# EAGLE design FioSaber (EAGLE 6.5.0)
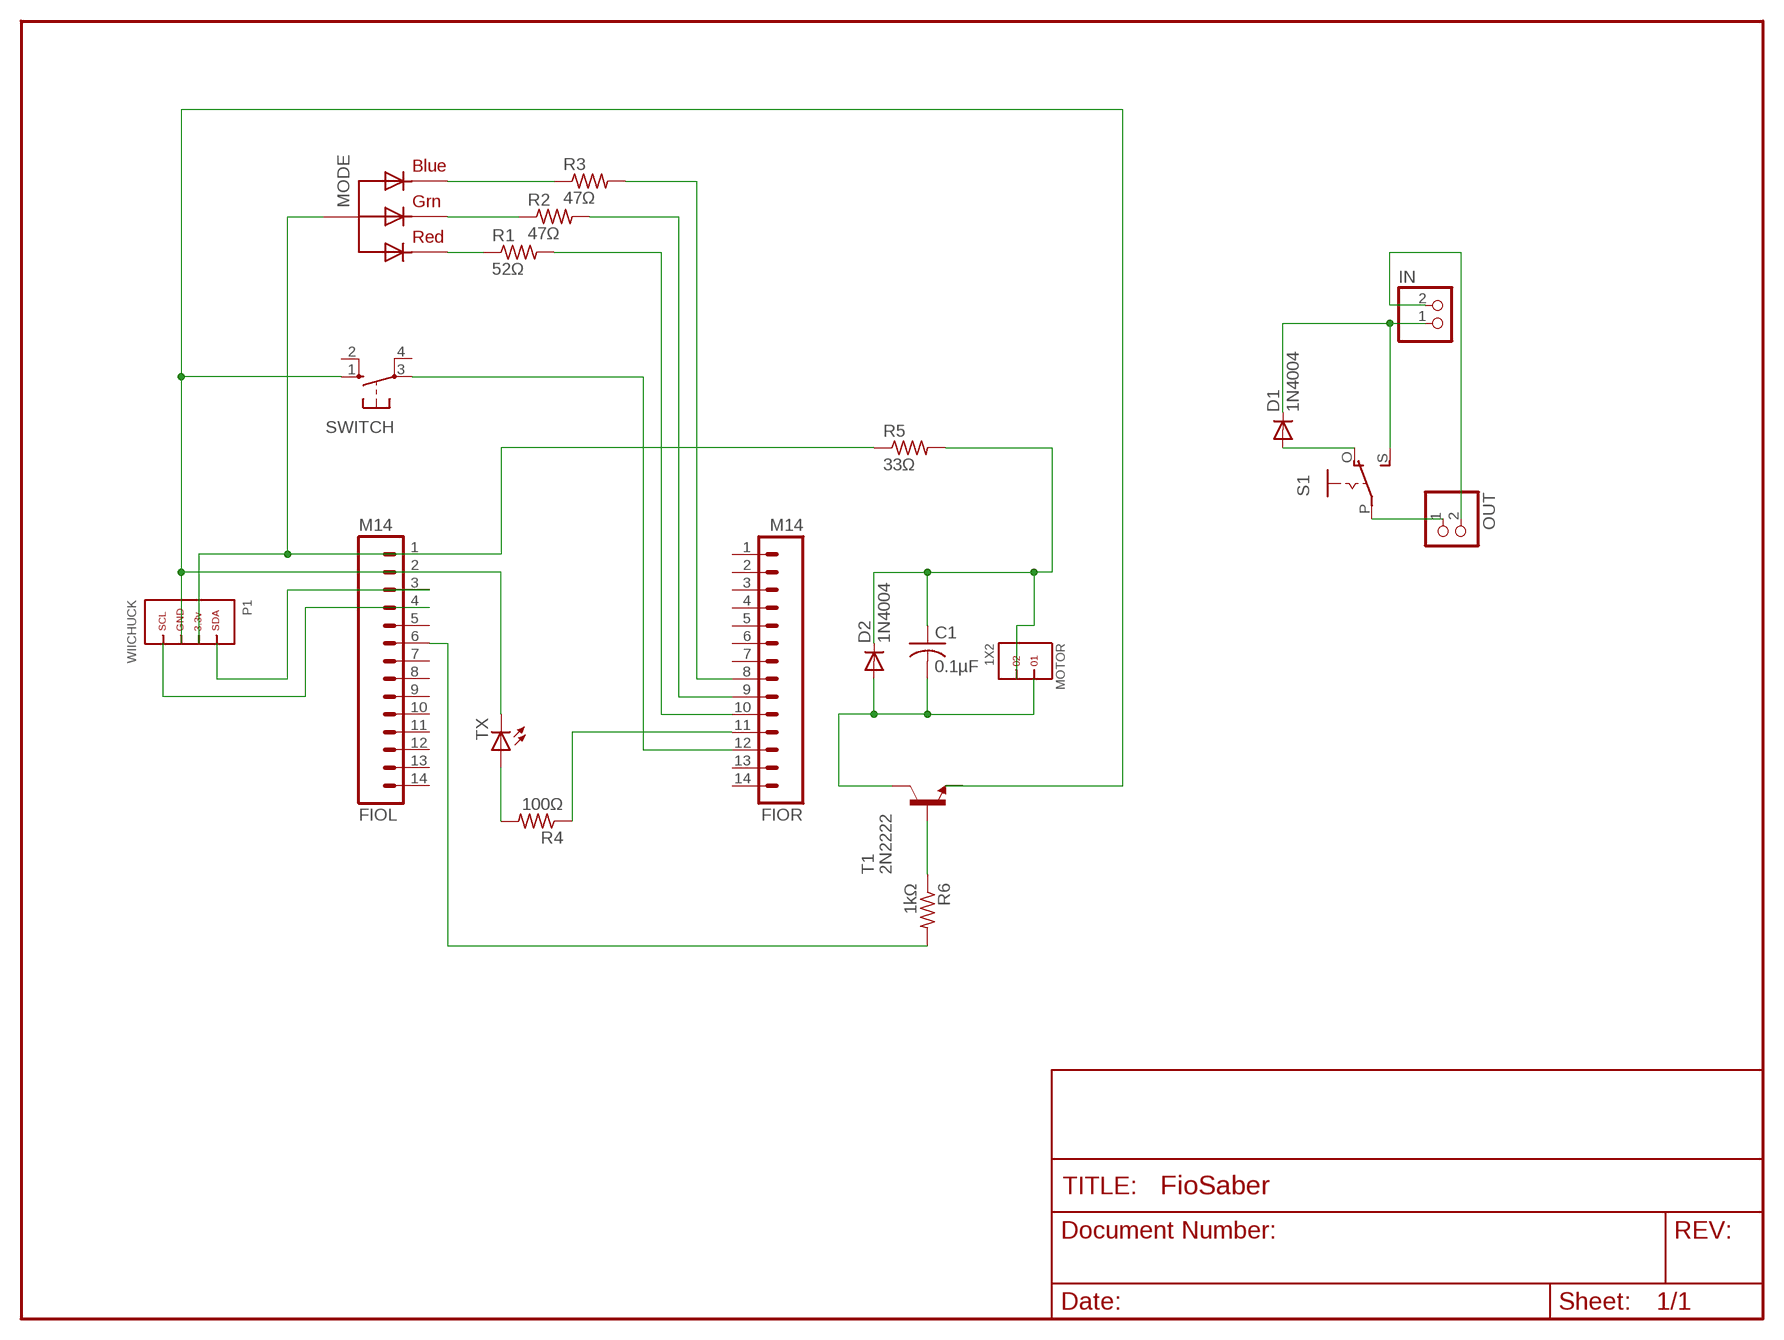
[diagram p0: schematic, sheet 1]

## Parts
C1  0.1µF  C-US025-025X050  [C025-025X050]
D1  1N4004  [DO41-10]
D2  1N4004  [DO41-10]
FIOL  M14  [1X14]
FIOR  M14  [1X14]
IN  JST_2PIN-THM-RA  [JST-PH-2-THM-RA]
MODE  RGBLED_CA-PIRANHA  [PIRANHA5MM]
MOTOR  1X2  [1X2]
OUT  JST_2PIN-THM-RA  [JST-PH-2-THM-RA]
P1  WIICHUCK  [MEMOREX_RECEIVER]
R1  52Ω  R-US_0207/7  [0207/7]
R2  47Ω  R-US_0207/7  [0207/7]
R3  47Ω  R-US_0207/7  [0207/7]
R4  100Ω  R-US_0207/7  [0207/7]
R5  33Ω  R-US_0207/7  [0207/7]
R6  1kΩ  R-US_0207/7  [0207/7]
S1  EG1218S  [EG1218]
SWITCH  10-XX  [B3F-10XX]
T1  2N2222  [TO92-EBC-OVAL]
TX  LED3MM  [LED3MM]

## Nets
N$1: FIOL.1 MODE.4(VCC) P1.SDA R5.1
N$2: D1.C IN.1 S1.S
N$3: FIOL.4 P1.GND
N$4: FIOL.3 P1.PWR
N$5: D1.A S1.O
N$6: MODE.2(RED) R1.1
N$8: MODE.3(GREEN) R2.1
N$9: MODE.1(BLUE) R3.1
N$10: OUT.1 S1.P
N$11: IN.2 OUT.2
N$12: FIOR.12 SWITCH.3(P)
N$13: FIOR.10 R1.2
N$14: FIOR.9 R2.2
N$15: FIOR.8 R3.2
N$16: FIOL.6 R6.2
N$17: FIOR.11 R4.1
N$18: R6.1 T1.B
N$19: C1.2 D2.A MOTOR.1 T1.C
N$20: C1.1 D2.C MOTOR.2 R5.2
N$24: FIOL.2 P1.SCL SWITCH.1(S) TX.K(C)
N$25: R4.2 TX.A
Unconnected: FIOL.5 FIOL.7 FIOL.8 FIOL.9 FIOL.10 FIOL.11 FIOL.12 FIOL.13 FIOL.14 FIOR.1 FIOR.2 FIOR.3 FIOR.4 FIOR.5 FIOR.6 FIOR.7 FIOR.13 FIOR.14 SWITCH.2(S1) SWITCH.4(P1) T1.E

## Library data of the parts
C1 = rcl:C-US: CAPACITOR, American symbol
D1 D2 = adafruit:1N4004: DIODE General purpose 1N400x type rectifier (With bigger pads) http://www.ladyada.net/library/pcb/eaglelibrary.html
FIOL FIOR = SparkFun:M14: Header 14 Standard 14-pin 0.1" header. Use with straight break away headers (SKU : PRT-00116), right angle break away headers (PRT-00553), swiss pins (PRT-00743), machine pins (PRT-00117), and female headers (PRT-00115).
IN OUT = adafruit:JST_2PIN: JST 2-Pin Connectors of various flavors SMT-RA (S2B-PH-SM4) 4UConnector #17311 SMT (B2B-PH-SM4) THM-RA (S2B-PH) THM (B2B-PH)
MODE = adafruit:RGBLED_CA: RGB LED, common-anode 5MM Staggered pins 5mm Piranha package http://www.ladyada.net/library/pcb/eaglelibrary.html
MOTOR = headers(.1in):1X2
P1 = nintendo:WIICHUCK
R1-R6 = adafruit:R-US_: RESISTOR, American symbol
S1 = adafruit:EG1218: SLIDING SWITCH 0.1" spacing through hole, vertical SPDT slide switch http://www.ladyada.net/library/pcb/eaglelibrary.html
SWITCH = switch-omron:10-XX: OMRON SWITCH; MPN: B3F-1000; OC_FARNELL: 176432; OC_NEWARK: 36M3542
T1 = adafruit:2N2222: NPN TRANSISTOR Big oval pads
TX = adafruit:LED: LED OSRAM: - CHIPLED LG R971, LG N971, LY N971, LG Q971, LY Q971, LO R971, LY R971 LH N974, LH R974 LS Q976, LO Q976, LY Q976 LO Q996 - Hyper CHIPLED LW Q18S LB Q993, LB Q99A, LB R99A - SideLED LS A670, LO A670, LY A670, LG A670, LP A670 LB A673, LV A673, LT A673, LW A673 LH A674 LY A675 LS A676, LA A676, LO A676, LY A676, LW A676 LS A679, LY A679, LG A679 - Hyper Micro SIDELED® LS Y876, LA Y876, LO Y876, LY Y876 LT Y87S - SmartLED LW L88C, LW L88S LB L89C, LB L89S, LG L890 LS L89K, LO L89K, LY L89K LS L896, LA L896, LO L896, LY L896 - TOPLED LS T670, LO T670, LY T670, LG T670, LP T670 LSG T670, LSP T670, LSY T670, LOP T670, LYG T670 LG T671, LOG T671, LSG T671 LB T673, LV T673, LT T673, LW T673 LH T674 LS T676, LA T676, LO T676, LY T676, LB T676, LH T676, LSB T676, LW T676 LB T67C, LV T67C, LT T67C, LS T67K, LO T67K, LY T67K, LW E67C LS E67B, LA E67B, LO E67B, LY E67B, LB E67C, LV E67C, LT E67C LW T67C LS T679, LY T679, LG T679 LS T770, LO T770, LY T770, LG T770, LP T770 LB T773, LV T773, LT T773, LW T773 LH T774 LS E675, LA E675, LY E675, LS T675 LS T776, LA T776, LO T776, LY T776, LB T776 LHGB T686 LT T68C, LB T68C - Hyper Mini TOPLED® LB M676 - Mini TOPLED Santana® LG M470 LS M47K, LO M47K, LY M47K Source: http://www.osram.convergy.de/

## Net classes
0 Default: width 0.203 mm, clearance 0.205 mm
2 LEDPower: width 0.203 mm
3 ButtonSignal: width 0.203 mm

## Board
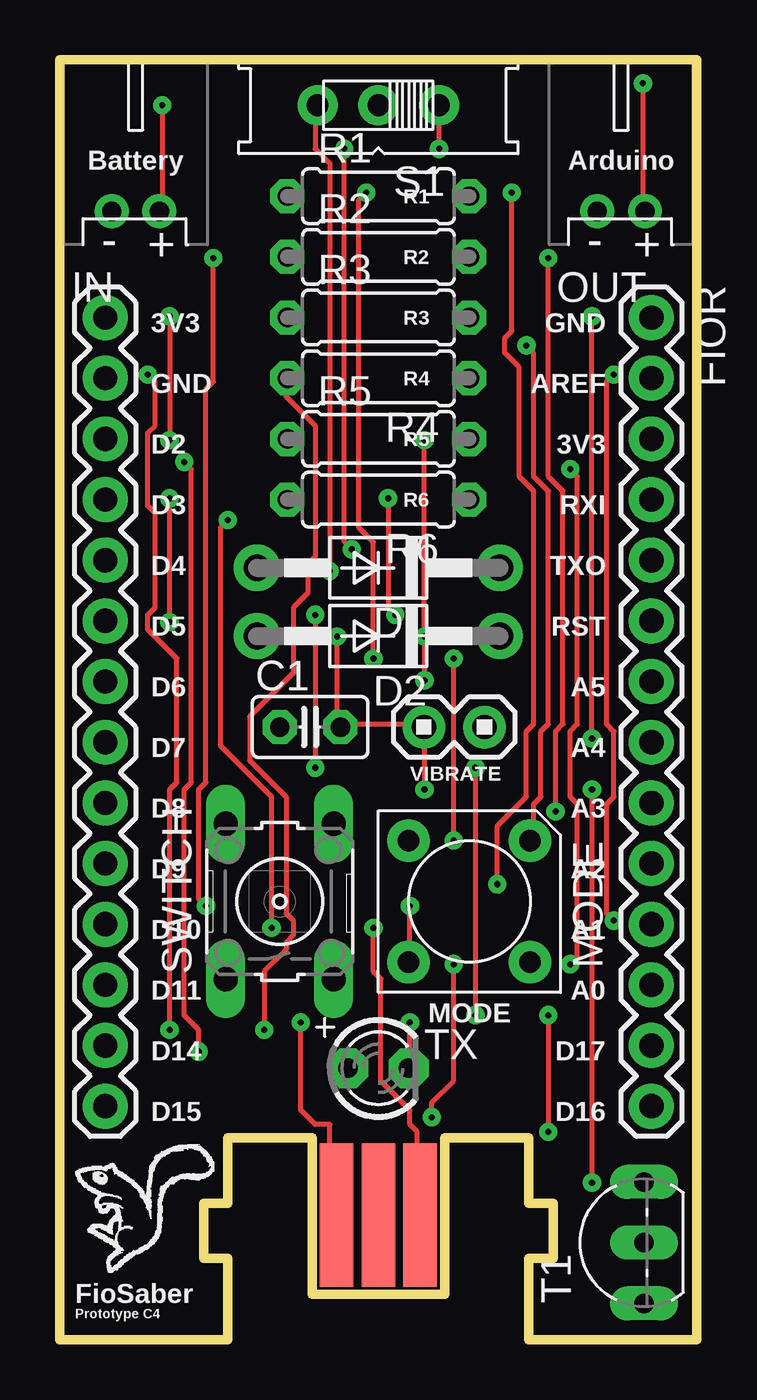
[diagram p1: board, top side]
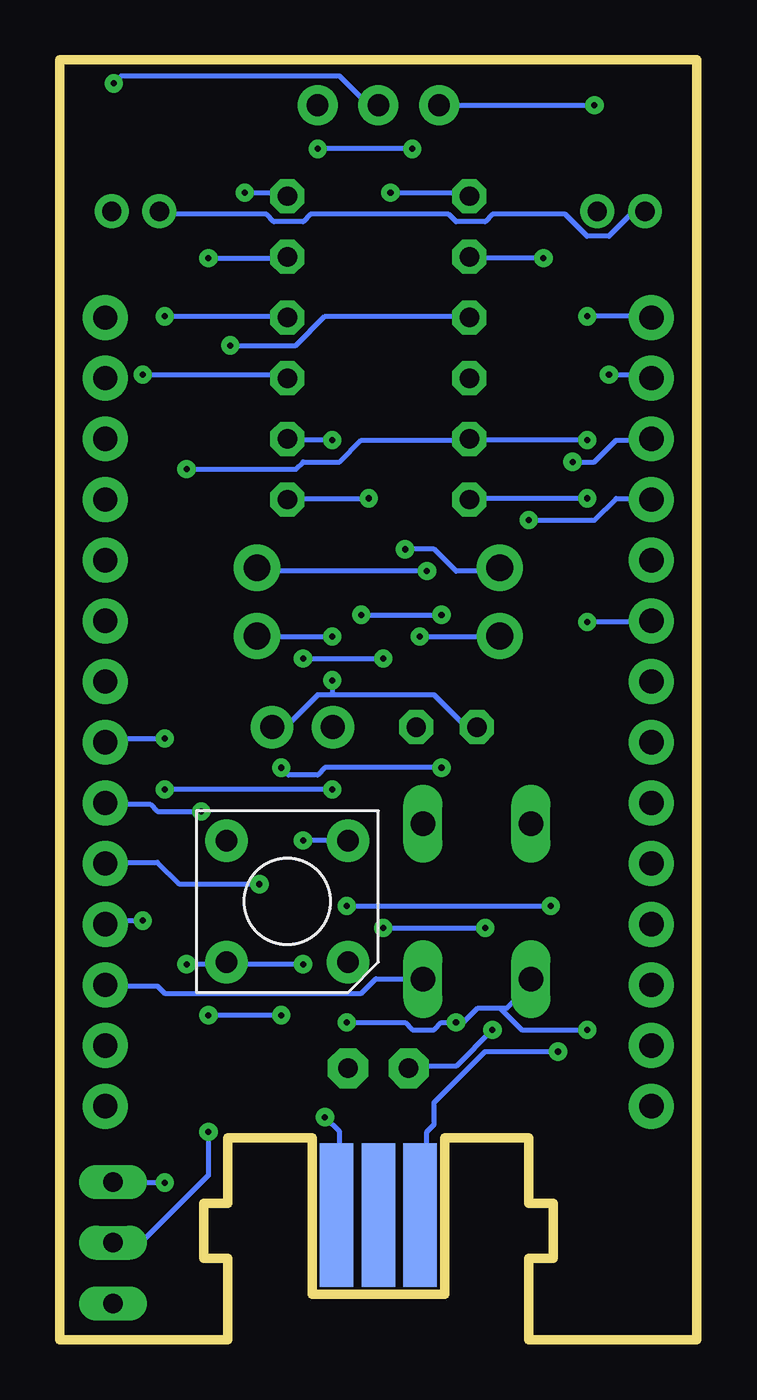
[diagram p2: board, bottom side, seen from below]

Size 26.67 x 53.59 mm. Coordinates in mm from the lower left corner, seen from the top.
Outline: 0,0 7.04,0 7.04,3.4 6.02,3.4 6.02,5.71 7.04,5.71 7.04,8.46 10.57,8.46 10.57,1.91 16.1,1.91 16.1,8.46 19.63,8.46 19.63,5.71 20.65,5.71 20.65,3.4 19.63,3.4 19.63,0 26.67,0 26.67,53.59 0,53.59 0,0
Copper layers (1*16): Top 0.035mm / dielectric 1.5mm / Bottom 0.035mm
Design rules "SparkFun *": minimum track width 8mil, minimum drill 10mil, track to track 7mil, track to pad 7mil, pad to pad 7mil, via to via 7mil, smd to smd 7mil, copper to edge 10mil, drill to drill 8mil, minimum pad ring 12mil, minimum via ring 10mil, stop-mask expansion 4mil, vias tented up to drill 20mil, thermal gap 10mil

### Footprints (pad centres in the part's own frame; a part is rotated, then mirrored left to right if it is on the bottom)
C025-025X050 = drill 0.813 octagon: 1 -1.27,0; 2 1.27,0
DO41-10 = drill 1.118 pad 1.93: A 5.08,0; C -5.08,0
1X14 = drill 1.016 pad 1.88: 1 0,0; 2 2.54,0; 3 5.08,0; 4 7.62,0; 5 10.16,0; 6 12.7,0; 7 15.24,0; 8 17.78,0; 9 20.32,0; 10 22.86,0; 11 25.4,0; 12 27.94,0; 13 30.48,0; 14 33.02,0
JST-PH-2-THM-RA = drill 0.8 pad 1.422: 1 1,0; 2 -1,0
PIRANHA5MM = drill 0.9 pad 1.778: 1 -2.54,2.54; 2 -2.54,-2.54; 3 2.54,-2.54; 4 2.54,2.54
1X2 = drill 1.016 pad 1.778: 1 0,0; 2 2.54,0
MEMOREX_RECEIVER = smd 1.4 x 6 bottom: ATT 0,5.6; PWR -1.75,5.6; SDA 1.75,5.6 | smd 1.4 x 6: GND 1.75,5.6; NC 0,5.6; SCL -1.75,5.6
0207/7 = drill 0.813 octagon: 1 -3.81,0; 2 3.81,0
EG1218 = drill 0.9 pad 1.676: O -2.54,0; P 0,0; S 2.54,0
B3F-10XX = drill 1.016 long: 1 -3.251,2.261; 2 3.251,2.261; 3 -3.251,-2.261; 4 3.251,-2.261
TO92-EBC-OVAL = drill 0.813 long: B 0,-1.27; C 2.54,-1.27; E -2.54,-1.27
LED3MM = drill 0.813 pad 1.676 octagon: A -1.27,0; K 1.27,0

### Placement (x,y rotation side)
C1  10.48,25.65 0 top
D1  13.33,32.32 180 top
D2  13.33,29.46 180 top
FIOL  1.91,42.8 270 top
FIOR  24.77,42.8 270 top
IN  3.17,47.24 0 top
MODE  17.15,18.35 270 top
MOTOR  15.24,25.65 0 top
OUT  23.5,47.24 0 top
P1  13.33,-0.38 0 top
R1  13.33,47.88 0 top
R2  13.33,45.34 0 top
R3  13.33,42.8 0 top
R4  13.33,40.26 180 top
R5  13.33,37.72 0 top
R6  13.33,35.18 180 top
S1  13.33,51.69 180 top
SWITCH  9.21,18.35 90 top
T1  23.18,4.06 90 top
TX  13.33,11.37 0 top

### Tracks (layer width: path | path; a pad name or v marks a point on that pad's centre or on a via)
N$1  (via drill 0.25)
  Top 0.203: v4.6,42.85 v4.6,37.67 | v16.48,15.72 16.48,10.85 15.57,9.93 v15.57,9.32 | v21.36,36.45 21.67,36.14 21.67,25.78 21.36,25.48 21.36,22.73 21.67,22.43 21.67,16.03 v21.36,15.72
  Bottom 0.203: v4.6,37.67 9.47,37.67 R5.1 9.78,37.67 14.05,37.67 14.96,36.75 16.48,36.75 16.79,36.45 v21.36,36.45 | v4.6,42.85 2.16,42.85 FIOL.1 | v16.48,15.72 19.53,15.72 MODE.4 19.84,15.72 v21.36,15.72 | v15.57,9.32 14.96,8.71 14.96,5.36 P1.SDA
N$2  (via drill 0.25)
  Top 0.203: v4.29,51.69 4.29,47.42 IN.1 | v11.3,32.18 11.3,49.25 10.69,49.86 10.69,51.69 S1.S
  Bottom 0.203: S1.S v4.29,51.69 | v11.3,32.18 18.31,32.18 D1.C
N$3  (via drill 0.25)
  Top 0.203: v7.04,34.31 6.73,34.01 6.73,24.87 8.87,22.73 v8.87,17.25 | v13.13,17.25 13.13,15.42 13.44,15.11 13.44,10.85 14.66,9.63 14.66,9.02 14.96,8.71 14.96,5.36 P1.GND
  Bottom 0.203: v7.04,34.31 4.29,34.31 3.38,35.23 2.16,35.23 FIOL.4 | v13.13,17.25 v8.87,17.25
N$4  (via drill 0.25)
  Top 0.203: v5.21,36.75 5.51,36.45 5.51,23.34 5.21,23.04 5.21,13.59 5.82,12.98 v5.82,12.06
  Bottom 0.203: v5.21,36.75 4.29,36.75 3.38,37.67 2.16,37.67 FIOL.3 | v5.82,12.06 8.87,12.06 11,9.93 11,9.02 11.3,8.71 11.3,7.19 11.61,6.88 11.61,5.36 P1.PWR
N$5  (via drill 0.25)
  Top 0.203: v15.88,49.86 S1.O | v11.91,49.86 11.91,33.4 v12.22,33.1
  Bottom 0.203: v11.91,49.86 v15.88,49.86 | v12.22,33.1 11,33.1 10.08,32.18 8.26,32.18 D1.A
N$6  (via drill 0.25)
  Top 0.203: v12.83,48.03 12.52,47.73 12.52,34.01 13.13,33.4 v13.13,28.52 | v16.48,20.9 v16.48,28.52
  Bottom 0.203: v12.83,48.03 9.78,48.03 R1.1 | v16.48,28.52 v13.13,28.52 | v16.48,20.9 14.66,20.9 MODE.2
N$8  (via drill 0.25)
  Top 0.203: v6.43,45.29 6.43,40.11 6.12,39.8 6.12,23.34 5.82,23.04 5.82,18.47 v6.12,18.16 | v14.66,18.16 14.66,16.03 MODE.3
  Bottom 0.203: v6.43,45.29 9.47,45.29 R2.1 | v14.66,18.16 v6.12,18.16
N$9  (via drill 0.25)
  Top 0.203: v19.53,41.63 19.84,41.33 19.84,36.14 20.45,35.53 20.45,25.78 20.14,25.48 20.14,22.73 19.84,22.43 19.84,20.9 MODE.1
  Bottom 0.203: v19.53,41.63 16.79,41.63 15.57,42.85 9.78,42.85 R3.1
N$10  (via drill 0.25)
  Top 0.203: v24.41,52.6 24.41,47.42 OUT.1
  Bottom 0.203: v24.41,52.6 24.11,52.91 14.96,52.91 13.74,51.69 S1.P
N$11
  Bottom 0.203: OUT.2 22.28,47.12 18.01,47.12 17.7,46.81 16.48,46.81 16.18,47.12 10.39,47.12 10.08,46.81 8.87,46.81 8.56,47.12 5.51,47.12 4.6,46.2 3.68,46.2 2.77,47.12 2.46,47.12 IN.2
N$12
  Bottom 0.203: SWITCH.3 11.61,15.11 13.44,15.11 14.05,14.5 22.28,14.5 22.58,14.81 24.71,14.81 FIOR.12
N$13  (via drill 0.25)
  Top 0.203: v18.92,48.03 18.92,42.24 18.62,41.93 18.62,41.33 19.23,40.72 19.23,36.14 19.84,35.53 19.84,25.78 19.53,25.48 19.53,22.73 18.31,21.51 v18.31,19.07
  Bottom 0.203: v18.92,48.03 17.4,48.03 R1.2 | v18.31,19.07 21.67,19.07 22.58,19.99 24.71,19.99 FIOR.10
N$14  (via drill 0.25)
  Top 0.203: v20.45,45.29 20.45,36.14 21.06,35.53 21.06,25.78 20.75,25.48 v20.75,22.12
  Bottom 0.203: v20.45,45.29 17.4,45.29 R2.2 | v20.75,22.12 22.58,22.12 22.89,22.43 24.71,22.43 FIOR.9
N$15  (via drill 0.25)
  Top 0.203: v22.28,25.17 v22.28,42.85
  Bottom 0.203: v22.28,42.85 17.4,42.85 R3.2 | v22.28,25.17 24.71,25.17 FIOR.8
N$16  (via drill 0.25)
  Top 0.203: v4.6,30.05 v4.6,35.23
  Bottom 0.203: v4.6,35.23 9.47,35.23 R6.2 | v4.6,30.05 2.16,30.05 FIOL.6
N$17  (via drill 0.25)
  Top 0.203: v23.19,40.41 22.89,40.11 22.89,25.78 23.19,25.48 23.19,22.73 22.89,22.43 22.89,17.86 v23.19,17.55
  Bottom 0.203: v23.19,40.41 17.4,40.41 R4.1 | v23.19,17.55 24.71,17.55 FIOR.11
N$18  (via drill 0.25)
  Top 0.203: v20.45,13.59 v20.45,8.71 | v17.4,23.95 v17.4,13.59 | v10.69,30.35 v10.69,23.95 | v14.05,30.35 13.74,30.66 v13.74,35.23
  Bottom 0.203: v20.45,8.71 20.45,6.88 23.19,4.14 24.41,4.14 T1.B | v17.4,13.59 v20.45,13.59 | v17.4,23.95 17.09,23.65 15.88,23.65 15.57,23.95 v10.69,23.95 | v14.05,30.35 v10.69,30.35 | v13.74,35.23 17.09,35.23 R6.1
N$19  (via drill 0.25)
  Top 0.203: v22.28,23.04 v22.28,6.58 | v15.27,23.04 15.27,25.48 MOTOR.1 14.96,25.78 11.91,25.78 C1.2 11.61,25.78 v11.61,29.44
  Bottom 0.203: v22.28,6.58 24.41,6.58 T1.C | v15.27,23.04 v22.28,23.04 | v11.61,29.44 8.26,29.44 D2.A
N$20  (via drill 0.25)
  Top 0.203: v15.27,37.67 v15.27,29.44 v15.27,27.61
  Bottom 0.203: 15.27,27 11,27 9.78,25.78 9.47,25.78 C1.1 | 15.27,27 15.88,27 17.09,25.78 17.7,25.78 MOTOR.2 | v15.27,37.67 17.09,37.67 R5.2 | v15.27,29.44 18.31,29.44 D2.C | v15.27,27.61 15.27,27
N$24  (via drill 0.25)
  Top 0.203: v3.68,40.41 3.99,40.11 3.99,38.28 3.68,37.97 3.68,34.92 3.99,34.62 3.99,30.66 3.68,30.35 3.68,29.74 4.9,28.52 4.9,23.34 4.6,23.04 v4.6,12.98 | v14.66,13.28 14.66,11.46 TX.K | v10.08,13.28 10.08,9.63 10.69,9.02 11.3,9.02 11.3,5.36 P1.SCL
  Bottom 0.203: v3.68,40.41 2.16,40.41 FIOL.2 | v4.6,12.98 7.34,12.98 8.26,13.89 | 8.26,13.89 9.17,13.89 9.78,13.28 v10.08,13.28 10.69,13.28 11,12.98 11.91,12.98 12.22,13.28 v14.66,13.28 | 8.26,13.89 7.95,13.89 7.04,14.81 SWITCH.1
N$25  (via drill 0.25)
  Top 0.203: v8.56,12.98 8.56,15.42 9.47,16.33 9.47,16.64 9.78,16.94 9.78,17.55 9.47,17.86 9.47,22.73 7.95,24.26 7.95,26.09 9.78,27.91 9.78,30.66 10.39,31.27 10.39,32.49 10.69,32.79 10.69,38.28 9.47,39.5 9.47,40.11 R4.2
  Bottom 0.203: v8.56,12.98 10.08,11.46 11.91,11.46 TX.A

### Text on the board
tPlace: Battery | Arduino | R1 | R2 | 3V3 | R3 | GND | R4 | GND | AREF | D2 | R5 | 3V3 | R6 | D3 | RXI | D4 | TXO | D5 | RST | D6 | A5 | D7 | A4 | VIBRATE | D8 | A3 | D9 | A2 | D10 | A1 | D11 | A0 | MODE | D14 | D17 | D15 | D16 | FioSaber | Prototype C4